# Altium project Guppy Buddy.PrjPCB (part 4 of 4)

## Sheet Cart.SchDoc: Cart
size Tabloid; ApprovedBy: NA; CompanyName: Cospan Design LLC; DrawnBy: David McCoy; Engineer: David McCoy; DocumentNumber: 12; Revision: A; SheetNumber: 12; SheetTotal: 18; Client: OSH; Project: Guppy Buddy; ProjectPrettyName: Guppy Buddy
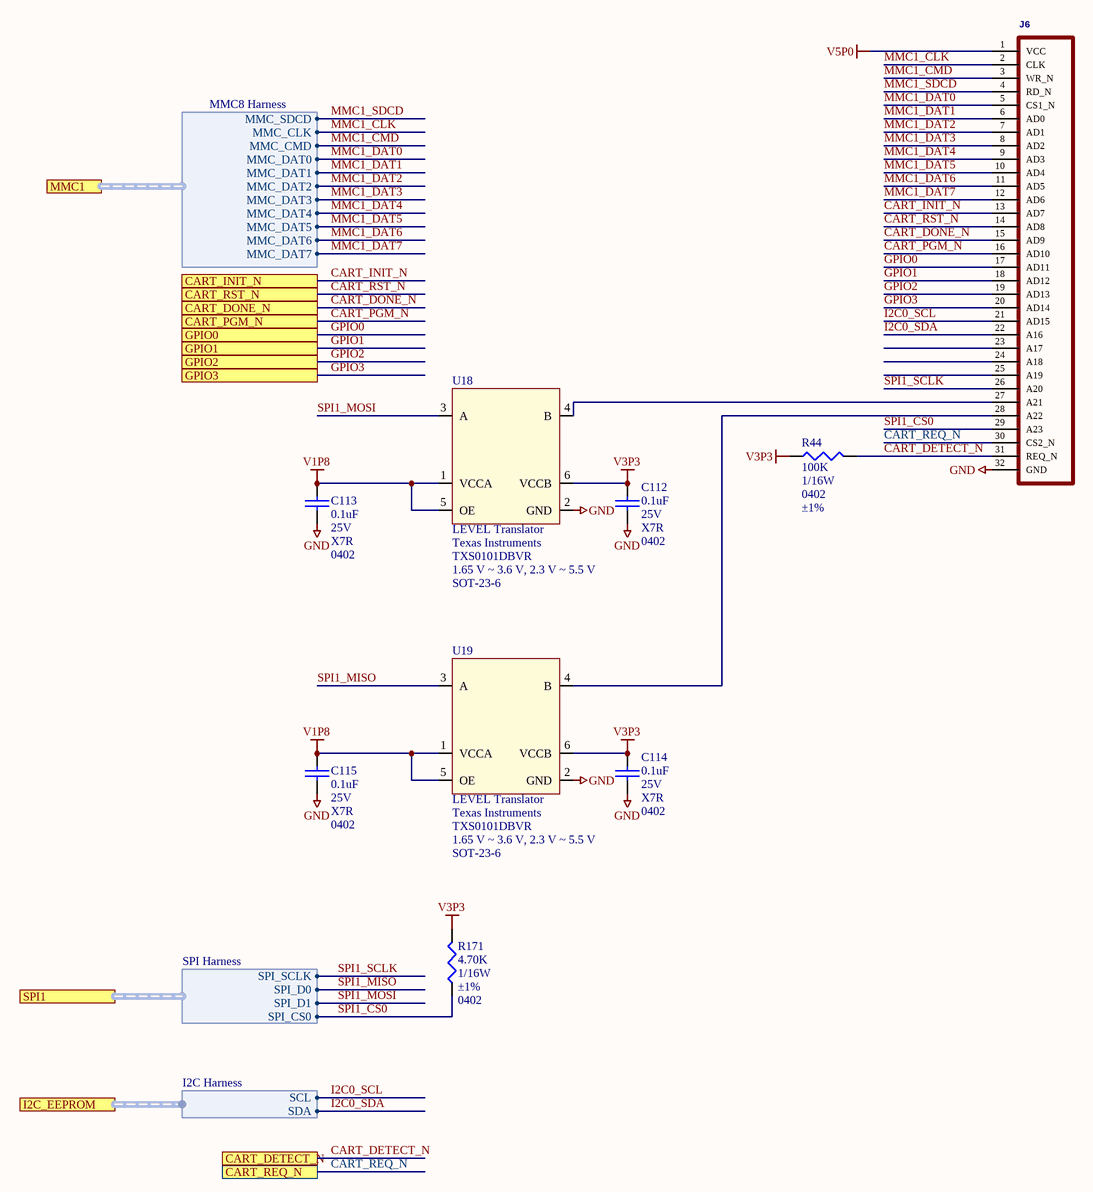
[diagram p5: Cart.SchDoc]

### Parts
C112  Capacitance: 0.1uF  Voltage - Rated: 25V  Temperature Coefficient: X7R  Package / Case: 0402  [C_0402]  (hidden comment: C_0402_0.1UF_25V)
C113  Capacitance: 0.1uF  Voltage - Rated: 25V  Temperature Coefficient: X7R  Package / Case: 0402  [C_0402]  (hidden comment: C_0402_0.1UF_25V)
C114  Capacitance: 0.1uF  Voltage - Rated: 25V  Temperature Coefficient: X7R  Package / Case: 0402  [C_0402]  (hidden comment: C_0402_0.1UF_25V)
C115  Capacitance: 0.1uF  Voltage - Rated: 25V  Temperature Coefficient: X7R  Package / Case: 0402  [C_0402]  (hidden comment: C_0402_0.1UF_25V)
J6  GB_CART1  [GB_CART]  (value not drawn)
R44  Resistance In Ohms: 100K  Power (Watts): 1/16W  Case: 0402  Tolerance: ±1%  [R_0402]  (hidden comment: R_0402_100K)
R171  Resistance In Ohms: 4.70K  Power (Watts): 1/16W  Tolerance: ±1%  Case: 0402  [R_0402]  (hidden comment: 4.7k Ohms)
U18  LEVEL Translator  Manufacturer: Texas Instruments  Manufacturer Part Number: TXS0101DBVR  Voltage - Supply: 1.65 V ~ 3.6 V, 2.3 V ~ 5.5 V  Package / Case: SOT-23-6  [TSOT-6]
U19  LEVEL Translator  Manufacturer: Texas Instruments  Manufacturer Part Number: TXS0101DBVR  Voltage - Supply: 1.65 V ~ 3.6 V, 2.3 V ~ 5.5 V  Package / Case: SOT-23-6  [TSOT-6]

### Ports
CART_DETECT_N, CART_DONE_N, CART_INIT_N, CART_PGM_N, CART_REQ_N, CART_RST_N, GPIO0, GPIO1, GPIO2, GPIO3, I2C_EEPROM (harness I2C Harness), MMC1 (harness MMC8 Harness), SPI1 (harness SPI Harness)

### Harnesses
SPI Harness: SPI_SCLK, SPI_D0, SPI_D1, SPI_CS0
MMC8 Harness: MMC_SDCD, MMC_CLK, MMC_CMD, MMC_DAT0, MMC_DAT1, MMC_DAT2, MMC_DAT3, MMC_DAT4, MMC_DAT5, MMC_DAT6, MMC_DAT7
I2C Harness: SCL, SDA

### Nets
GND: C112.1 C113.1 C114.1 C115.1 J6.32(GND) U18.2(GND) U19.2(GND)
V1P8: C113.2 C115.2 U18.1(VCCA) U18.5(OE) U19.1(VCCA) U19.5(OE)
V3P3: C112.2 C114.2 R44.2 R171.1 U18.6(VCCB) U19.6(VCCB)
V5P0: J6.1(VCC)
CART_DETECT_N: J6.31(REQ_N) R44.1 ; port CART_DETECT_N
CART_DONE_N: J6.15(AD9) ; port CART_DONE_N
CART_INIT_N: J6.13(AD7) ; port CART_INIT_N
CART_PGM_N: J6.16(AD10) ; port CART_PGM_N
CART_REQ_N: J6.30(CS2_N) ; port CART_REQ_N
CART_RST_N: J6.14(AD8) ; port CART_RST_N
GPIO0: J6.17(AD11) ; port GPIO0
GPIO1: J6.18(AD12) ; port GPIO1
GPIO2: J6.19(AD13) ; port GPIO2
GPIO3: J6.20(AD14) ; port GPIO3
I2C0_SCL: J6.21(AD15) ; port I2C_EEPROM.SCL
I2C0_SDA: J6.22(A16) ; port I2C_EEPROM.SDA
MMC1_CLK: J6.2(CLK) ; port MMC1.MMC_CLK
MMC1_CMD: J6.3(WR_N) ; port MMC1.MMC_CMD
MMC1_DAT0: J6.5(CS1_N) ; port MMC1.MMC_DAT0
MMC1_DAT1: J6.6(AD0) ; port MMC1.MMC_DAT1
MMC1_DAT2: J6.7(AD1) ; port MMC1.MMC_DAT2
MMC1_DAT3: J6.8(AD2) ; port MMC1.MMC_DAT3
MMC1_DAT4: J6.9(AD3) ; port MMC1.MMC_DAT4
MMC1_DAT5: J6.10(AD4) ; port MMC1.MMC_DAT5
MMC1_DAT6: J6.11(AD5) ; port MMC1.MMC_DAT6
MMC1_DAT7: J6.12(AD6) ; port MMC1.MMC_DAT7
MMC1_SDCD: J6.4(RD_N) ; port MMC1.MMC_SDCD
SPI1_CS0: J6.29(A23) R171.2 ; port SPI1.SPI_CS0
SPI1_MISO: U19.3(A) ; port SPI1.SPI_D0
SPI1_MOSI: U18.3(A) ; port SPI1.SPI_D1
SPI1_SCLK: J6.26(A20) ; port SPI1.SPI_SCLK
NetJ6_27: J6.27(A21) U18.4(B)
NetJ6_28: J6.28(A22) U19.4(B)

Not connected (* = marked no-connect by the designer): J6 23(A17) 24(A18) 25(A19)

### Notes on the sheet
- Project:
- http://www.cospandesign.com
- Cospan Design
- Document:
- Engineer:
- Title:
- Client:
- Approved By:
- Revision:
- Date:
- Number:
- of

### Library data of the parts
C112-C115 = C_0402_0.1UF_25V: CAP CER 0.1UF 25V X6S 0402; Manufacturer 1: Yageo; Manufacturer Part Number 1: CC0402KRX7R8BB104; Description 1: Cap Ceramic 0.1uF 25V X7R 10% SMD 0402 125C Paper T/R; Tolerance: 10%; Dissipation Factor: 3.5%; ComponentLink1URL: https://product.tdk.com/info/en/catalog/datasheets/mlcc_commercial_general_en.pdf; ComponentLink1Description: https://product.tdk.com/info/en/catalog/datasheets/mlcc_commercial_general_en.pdf; Supplier 1: Digi-Key; Supplier Part Number 1: 311-2077-1-ND; Stock 1: 0; Pricing 1: 1=0.1, 10=0.048, 100=0.0215, 500=0.01534, 1000=0.01205, 2500=0.01095, 5000=0.01007 (USD); Mount: Surface Mount; Case/Package: 0402; Case Code (Imperial): 0402; Case Code (Metric): 1005; Min Operating Temperature: -55°C; Max Operating Temperature: 125°C; Voltage Rating: 25V; Voltage Rating (DC): 25V; Packaging: Tape and Reel; Dielectric: X7R; Termination: SMD/SMT; Composition: Ceramic; Length: 1mm; Height: 0.5mm; Width: 0.02inch; Thickness: 0.022inch; Depth: 0.5mm; Radiation Hardening: No; Lead Free: Lead Free; Halogen Free: Halogen Free; ComponentLink2URL: https://datasheet.ciiva.com/11464/upy-gphc-x7r-6-3v-to-50v-8-11464889.pdf; ComponentLink2Description: https://datasheet.ciiva.com/11464/upy-gphc-x7r-6-3v-to-50v-8-11464889.pdf; ComponentLink3URL: https://datasheet.ciiva.com/13210/upy-gphc-x7r-6-3v-to-50v-8-12304-13210908.pdf; ComponentLink3Description: https://datasheet.ciiva.com/13210/upy-gphc-x7r-6-3v-to-50v-8-12304-13210908.pdf; ComponentLink4URL: https://datasheet.ciiva.com/17437/upy-gphc-x7r-6-3v-to-50v-8-17437357.pdf; ComponentLink4Description: https://datasheet.ciiva.com/17437/upy-gphc-x7r-6-3v-to-50v-8-17437357.pdf
J6 = J_GB_CART: Manufacturer 1: Amazon; DeviceName: 1; SymbolName_1: GB_CART; LibraryName: alex; DeviceSetName: GB_CART; Manufacturer Part Number 1: https://smile.amazon.com/Replacement-Cartridge-Card-Reader-Repair-Nintendo/dp/B077FV5W1L/ref=smi_ge_cnf_cnf_smi?_encoding=UTF8&adFormat=grid&adId=B077FV5W1L&adMode=auto&adType=smart&creativeASIN=B077FV5W1L&ie=UTF8&imprToken=YMtJVGSB8f0LFilQNy7ahg&impressionTimestamp=1529762984662&linkCode=w41&linkId=45a1439b5f48b7417e3978fa0774d918&pldnNewCustomer=1&ref-refURL=https%3A%2F%2Fhandheldlegend.com%2Fproducts%2Fgame-boy-cartridge-slot&slotNum=0&tag=hanhelleg-20
R44 = R_0402_100K: RES SMD 100K OHM 1% 1/16W 0402; Manufacturer: Yageo; Manufacturer Part Number: RC0402FR-07100KL; Temperature Coefficient: ±100ppm/°C; Supplier 1: Digi-Key; RoHS: RoHS Compliant; Category: Resistors; Stock 1: 4989982; Pricing 1: 1=0.1, 10=0.013, 25=0.0096, 100=0.0054, 250=0.00412, 500=0.00328, 1000=0.00242, 2500=0.0021, 5000=0.00173 (USD); Packaging: Cut Tape (CT); Resistance (Ohms): 100k; Composition: Thick Film; Features: Moisture Resistant; Operating Temperature: -55°C ~ 155°C; Package / Case: 0402 (1005 Metric); Supplier Device Package: 0402; Size / Dimension: 0.039" L x 0.020" W (1.00mm x 0.50mm); Height: 0.016" (0.40mm); Number of Terminations: 2; ComponentLink1URL: http://www.yageo.com/NewPortal/yageodocoutput?fileName=/pdf/R-Chip/PYu-RC_Group_51_RoHS_L_3.pdf; ComponentLink1Description: http://www.yageo.com/NewPortal/yageodocoutput?fileName=/pdf/R-Chip/PYu-RC_Group_51_RoHS_L_3.pdf; Supplier Part Number 1: 311-100KLRCT-ND
R171 = R_0402_4.70K: RES 4.70K OHM 1/16W 1% 0402 SMD; Manufacturer: Yageo; Manufacturer Part Number: RC0402FR-074K7L; Temperature Coefficient: ±100ppm/°C; Supplier 1: Digi-Key; Supplier Part Number 1: 311-4.7KLRCT-ND; RoHS: RoHS Compliant; Category: Resistors; Stock 1: 3610; Pricing: 10=0.014, 100=0.0063, 500=0.00382, 1000=0.0027, 5000=0.00203 (USD); Resistance (Ohms): 4.7K; Composition: Thick Film; Features: -; Package / Case: 0402 (1005 Metric); Size / Dimension: 0.039" L x 0.020" W (1.00mm x 0.50mm); Height: 0.016" (0.40mm); Number of Terminations: 2; Packaging: Cut Tape (CT); ComponentLink1URL: http://www.yageo.com/documents/recent/PYu-RC0402_51_RoHS_L_6.pdf; ComponentLink1Description: http://www.yageo.com/documents/recent/PYu-RC0402_51_RoHS_L_6.pdf
U18 U19 = U_TXS0101DBVR: IC V-LEVEL TRANSL BI-DIR SOT23-6; Logic Function: Translator, Bidirectional, Open Drain; Number of Bits: 1; Input Type: Voltage; Data Rate: 24Mbps; Differential - Input:Output: No/No; Propagation Delay (Max): 4.6ns; Supplier 1: Digi-Key; RoHS: RoHS Compliant; Category: Integrated Circuits (ICs); Stock 1: 19555; Pricing 1: 1=0.82, 10=0.722, 25=0.638, 100=0.556, 250=0.484, 500=0.412, 1000=0.33 (USD); Packaging: Cut Tape (CT); Output Type: Voltage; Number of Channels: 1; Number of Outputs/Channel: 1; Operating Temperature: -40°C ~ 85°C; Supplier Device Package: SOT-23-6; ComponentLink1URL: http://www.ti.com/lit/ds/symlink/txs0101.pdf; ComponentLink1Description: http://www.ti.com/lit/ds/symlink/txs0101.pdf; Supplier Part Number 1: 296-22863-1-ND

## Sheet Audio Codec.SchDoc: Audio Codec
size Tabloid; ApprovedBy: NA; CompanyName: Cospan Design LLC; DrawnBy: David McCoy; Engineer: David McCoy; DocumentNumber: 13; Revision: A; SheetNumber: 13; SheetTotal: 18; Client: OSH; Project: Guppy Buddy; ProjectPrettyName: Guppy Buddy
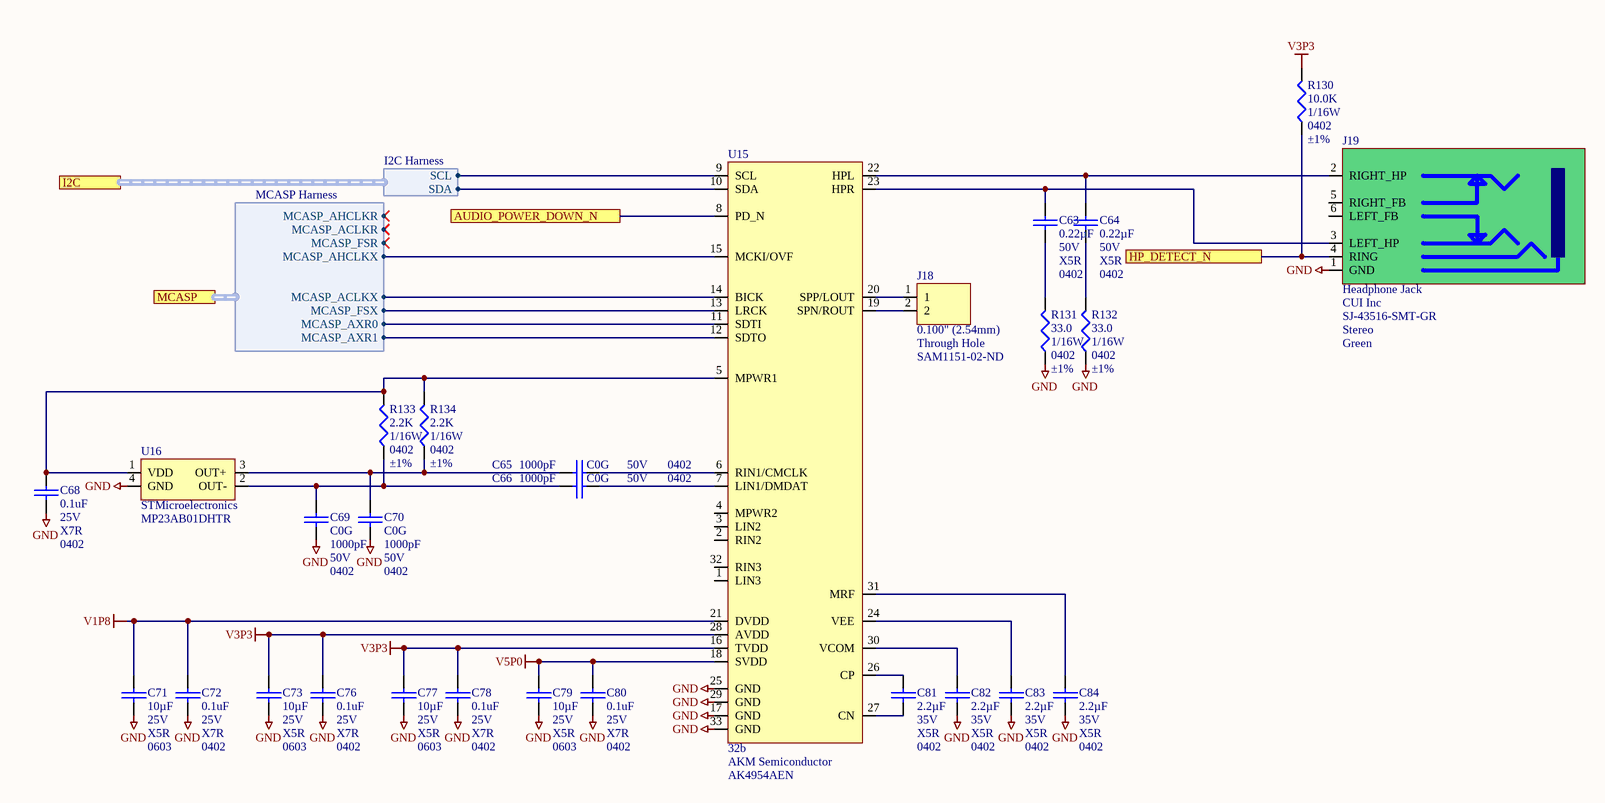
[diagram p6: Audio Codec.SchDoc]

### Parts
C63  Capacitance: 0.22µF  Voltage - Rated: 50V  Temperature Coefficient: X5R  Package / Case: 0402  [C_ERA-0402]  (hidden comment: C_0402_0.22UF_50V)
C64  Capacitance: 0.22µF  Voltage - Rated: 50V  Temperature Coefficient: X5R  Package / Case: 0402  [C_ERA-0402]  (hidden comment: C_0402_0.22UF_50V)
C65  Temperature Coefficient: C0G  Voltage - Rated: 50V  Package / Case: 0402  [C_ERA-0402]  (hidden comment: 1000pF)
C66  Temperature Coefficient: C0G  Voltage - Rated: 50V  Package / Case: 0402  [C_ERA-0402]  (hidden comment: 1000pF)
C68  Capacitance: 0.1uF  Voltage - Rated: 25V  Temperature Coefficient: X7R  Package / Case: 0402  [C_0402]  (hidden comment: C_0402_0.1UF_25V)
C69  Temperature Coefficient: C0G  Voltage - Rated: 50V  Package / Case: 0402  [C_ERA-0402]  (hidden comment: 1000pF)
C70  Temperature Coefficient: C0G  Voltage - Rated: 50V  Package / Case: 0402  [C_ERA-0402]  (hidden comment: 1000pF)
C71  Capacitance: 10µF  Voltage - Rated: 25V  Temperature Coefficient: X5R  Package / Case: 0603  [C_ERA-0603]  (hidden comment: C_0603_10µF)
C72  Capacitance: 0.1uF  Voltage - Rated: 25V  Temperature Coefficient: X7R  Package / Case: 0402  [C_0402]  (hidden comment: C_0402_0.1UF_25V)
C73  Capacitance: 10µF  Voltage - Rated: 25V  Temperature Coefficient: X5R  Package / Case: 0603  [C_ERA-0603]  (hidden comment: C_0603_10µF)
C76  Capacitance: 0.1uF  Voltage - Rated: 25V  Temperature Coefficient: X7R  Package / Case: 0402  [C_0402]  (hidden comment: C_0402_0.1UF_25V)
C77  Capacitance: 10µF  Voltage - Rated: 25V  Temperature Coefficient: X5R  Package / Case: 0603  [C_ERA-0603]  (hidden comment: C_0603_10µF)
C78  Capacitance: 0.1uF  Voltage - Rated: 25V  Temperature Coefficient: X7R  Package / Case: 0402  [C_0402]  (hidden comment: C_0402_0.1UF_25V)
C79  Capacitance: 10µF  Voltage - Rated: 25V  Temperature Coefficient: X5R  Package / Case: 0603  [C_ERA-0603]  (hidden comment: C_0603_10µF)
C80  Capacitance: 0.1uF  Voltage - Rated: 25V  Temperature Coefficient: X7R  Package / Case: 0402  [C_0402]  (hidden comment: C_0402_0.1UF_25V)
C81  Capacitance: 2.2µF  Voltage - Rated: 35V  Temperature Coefficient: X5R  Package / Case: 0402  [C_ERA-0402]  (hidden comment: C_0402_2.2uF_35V)
C82  Capacitance: 2.2µF  Voltage - Rated: 35V  Temperature Coefficient: X5R  Package / Case: 0402  [C_ERA-0402]  (hidden comment: C_0402_2.2uF_35V)
C83  Capacitance: 2.2µF  Voltage - Rated: 35V  Temperature Coefficient: X5R  Package / Case: 0402  [C_ERA-0402]  (hidden comment: C_0402_2.2uF_35V)
C84  Capacitance: 2.2µF  Voltage - Rated: 35V  Temperature Coefficient: X5R  Package / Case: 0402  [C_ERA-0402]  (hidden comment: C_0402_2.2uF_35V)
J18  Pitch: 0.100" (2.54mm)  Mounting Type: Through Hole  Supplier Part Number 1: SAM1151-02-ND  [1X2_HOLES_VERTICAL_FEMALE_HEADRER]  (hidden comment: J_HDR1X2_THRHOLE_VERT_FEMALE)
J19  Headphone Jack  Manufacturer: CUI Inc  Manufacturer Part Number: SJ-43516-SMT-GR  Signal Lines: Stereo  Color: Green  [HEADPHONE_JACK]
R130  Resistance In Ohms: 10.0K  Power (Watts): 1/16W  Case: 0402  Tolerance: ±1%  [R_0402]  (hidden comment: R_0402_10.0K)
R131  Resistance In Ohms: 33.0  Power (Watts): 1/16W  Case: 0402  Tolerance: ±1%  [R_0402]  (hidden comment: R_0402_33)
R132  Resistance In Ohms: 33.0  Power (Watts): 1/16W  Case: 0402  Tolerance: ±1%  [R_0402]  (hidden comment: R_0402_33)
R133  Resistance In Ohms: 2.2K  Power (Watts): 1/16W  Case: 0402  Tolerance: ±1%  [R_0402]  (hidden comment: R_0402_2.2K)
R134  Resistance In Ohms: 2.2K  Power (Watts): 1/16W  Case: 0402  Tolerance: ±1%  [R_0402]  (hidden comment: R_0402_2.2K)
U15  Resolution: 32b  Manufacturer 1: AKM Semiconductor  Manufacturer Part Number 1: AK4954AEN  [QFN40P400X400X80_HS-33N]  (hidden comment: U_AK4954AEN)
U16  Manufacturer 1: STMicroelectronics  Manufacturer Part Number 1: MP23AB01DHTR  [RHLGA]  (hidden comment: U_MP23AB01DHTR)

### Ports
AUDIO_POWER_DOWN_N, HP_DETECT_N, I2C (harness I2C Harness), MCASP (harness MCASP Harness)

### Harnesses
I2C Harness: SCL, SDA
MCASP Harness: MCASP_ACLKX, MCASP_FSX, MCASP_AXR0, MCASP_AHCLKR, MCASP_ACLKR, MCASP_FSR, MCASP_AXR1, MCASP_AHCLKX

### Nets
GND: C68.1 C69.2 C70.2 C71.1 C72.1 C73.1 C76.1 C77.1 C78.1 C79.1 C80.1 C82.1 C83.1 C84.1 J19.1(GND) R131.2 R132.2 U15.17(GND) U15.25(GND) U15.29(GND) U15.33(GND) U16.4(GND)
V1P8: C71.2 C72.2 U15.21(DVDD)
V3P3: C73.2 C76.2 C77.2 C78.2 R130.1 U15.16(TVDD) U15.28(AVDD)
V5P0: C79.2 C80.2 U15.18(SVDD)
HP_DETECT_N: J19.4(RING) R130.2 ; port HP_DETECT_N
NetC63_1: C63.1 R131.1
NetC63_2: C63.2 J19.3(LEFT_HP) U15.23(HPR)
NetC64_1: C64.1 R132.1
NetC64_2: C64.2 J19.2(RIGHT_HP) U15.22(HPL)
NetC65_1: C65.1 U15.6(RIN1/CMCLK)
NetC65_2: C65.2 C70.1 R134.2 U16.3(OUT+)
NetC66_1: C66.1 U15.7(LIN1/DMDAT)
NetC66_2: C66.2 C69.1 R133.2 U16.2(OUT-)
NetC68_2: C68.2 R133.1 R134.1 U15.5(MPWR1) U16.1(VDD)
NetC81_1: C81.1 U15.27(CN)
NetC81_2: C81.2 U15.26(CP)
NetC82_2: C82.2 U15.30(VCOM)
NetC83_2: C83.2 U15.24(VEE)
NetC84_2: C84.2 U15.31(MRF)
NetJ18_1: J18.1 U15.20(SPP/LOUT)
NetJ18_2: J18.2 U15.19(SPN/ROUT)
NetU15_8: U15.8(PD_N) ; port AUDIO_POWER_DOWN_N
NetU15_9: U15.9(SCL) ; port I2C.SCL
NetU15_10: U15.10(SDA) ; port I2C.SDA
NetU15_11: U15.11(SDTI) ; port MCASP.MCASP_AXR0
NetU15_12: U15.12(SDTO) ; port MCASP.MCASP_AXR1
NetU15_13: U15.13(LRCK) ; port MCASP.MCASP_FSX
NetU15_14: U15.14(BICK) ; port MCASP.MCASP_ACLKX
NetU15_15: U15.15(MCKI/OVF) ; port MCASP.MCASP_AHCLKX

Not connected (* = marked no-connect by the designer): J19 5(RIGHT_FB) 6(LEFT_FB); U15 1(LIN3) 2(RIN2) 3(LIN2) 4(MPWR2) 32(RIN3)

### Notes on the sheet
- Project:
- http://www.cospandesign.com
- Cospan Design
- Document:
- Engineer:
- Title:
- Client:
- Approved By:
- Revision:
- Date:
- Number:
- of

### Library data of the parts
C63 C64 = C_0402_0.22UF_50V: CAP CER 0.22UF 50V X5R 0402; Manufacturer: Taiyo Yuden; Manufacturer Part Number: UMK105BJ224KV-F; Tolerance: ±10%; Supplier 1: Digi-Key; RoHS: RoHS Compliant; Category: Capacitors; Stock 1: 141424; Pricing 1: 1=0.35, 10=0.263, 50=0.1532, 100=0.1225, 250=0.08752, 500=0.0595, 1000=0.04813, 5000=0.03763 (USD); Packaging: Digi-Reel®; Mounting Type: Surface Mount, MLCC; Operating Temperature: -55°C ~ 85°C; Applications: General Purpose; Ratings: -; Size / Dimension: 0.039" L x 0.020" W (1.00mm x 0.50mm); Height - Seated (Max): -; Thickness (Max): 0.022" (0.55mm); Lead Spacing: -; Features: -; Lead Style: -; ComponentLink1URL: http://ds.yuden.co.jp/TYCOMPAS/ut/detail.do?productNo=UMK105BJ224KV-F&fileName=UMK105BJ224KV-F_SS&mode=specSheetDownload; ComponentLink1Description: http://ds.yuden.co.jp/TYCOMPAS/ut/detail.do?productNo=UMK105BJ224KV-F&fileName=UMK105BJ224KV-F_SS&mode=specSheetDownload; Supplier Part Number 1: 587-3500-6-ND
C65 C66 C69 C70 = C_0402_1000PF_50V: CAP CER 1000PF 50V C0G 0402; Manufacturer: Murata Electronics North America; Manufacturer Part Number: GRM1555C1H102JA01D; Tolerance: ±5%; Supplier 1: Digi-Key; RoHS: RoHS Compliant; Category: Capacitors; Stock 1: 1327660; Pricing 1: 10=0.073, 100=0.0429, 500=0.02476, 1000=0.01716 (USD); Mounting Type: Surface Mount, MLCC; Operating Temperature: -55°C ~ 125°C; Features: -; Applications: General Purpose; Ratings: -; Size / Dimension: 0.040" L x 0.020" W (1.00mm x 0.50mm); Lead Spacing: -; Thickness: 0.50mm; Packaging: Cut Tape (CT); Lead Style: -; ComponentLink1URL: http://search.murata.co.jp/Ceramy/image/img/PDF/ENG/GRM1555C1H102JA01.pdf; ComponentLink1Description: http://search.murata.co.jp/Ceramy/image/img/PDF/ENG/GRM1555C1H102JA01.pdf; Supplier Part Number 1: 490-3244-1-ND; Capacitance: 1000pF
C68 C72 C76 C78 C80 = C_0402_0.1UF_25V: as C112 on sheet Cart; ComponentLink1URL: https://product.tdk.com/info/en/catalog/datasheets/mlcc_commercial_general_en.pdf; ComponentLink1Description: https://product.tdk.com/info/en/catalog/datasheets/mlcc_commercial_general_en.pdf; Supplier 1: Digi-Key; Supplier Part Number 1: 311-2077-1-ND; Stock 1: 0; Pricing 1: 1=0.1, 10=0.048, 100=0.0215, 500=0.01534, 1000=0.01205, 2500=0.01095, 5000=0.01007 (USD); Mount: Surface Mount; Case/Package: 0402; Case Code (Imperial): 0402; Case Code (Metric): 1005; Min Operating Temperature: -55°C; Max Operating Temperature: 125°C; Voltage Rating: 25V; Voltage Rating (DC): 25V; Packaging: Tape and Reel; Dielectric: X7R; Termination: SMD/SMT; Composition: Ceramic; Length: 1mm; Height: 0.5mm; Width: 0.02inch; Thickness: 0.022inch; Depth: 0.5mm; Radiation Hardening: No; Lead Free: Lead Free; Halogen Free: Halogen Free; ComponentLink2URL: https://datasheet.ciiva.com/11464/upy-gphc-x7r-6-3v-to-50v-8-11464889.pdf; ComponentLink2Description: https://datasheet.ciiva.com/11464/upy-gphc-x7r-6-3v-to-50v-8-11464889.pdf; ComponentLink3URL: https://datasheet.ciiva.com/13210/upy-gphc-x7r-6-3v-to-50v-8-12304-13210908.pdf; ComponentLink3Description: https://datasheet.ciiva.com/13210/upy-gphc-x7r-6-3v-to-50v-8-12304-13210908.pdf; ComponentLink4URL: https://datasheet.ciiva.com/17437/upy-gphc-x7r-6-3v-to-50v-8-17437357.pdf; ComponentLink4Description: https://datasheet.ciiva.com/17437/upy-gphc-x7r-6-3v-to-50v-8-17437357.pdf
C71 C73 C77 C79 = C_0603_10µF: CAP CER 10UF 16V X5R 0603; Manufacturer: Murata Electronics North America; Manufacturer Part Number: GRM188R61C106MA73D; Tolerance: ±20%; Supplier 1: Digi-Key; RoHS: RoHS Compliant; Category: Capacitors; Stock 1: 450536; Pricing 1: 1=0.35, 10=0.303, 50=0.184, 100=0.1516, 250=0.12124, 500=0.11042, 1000=0.09959 (USD); Packaging: Cut Tape (CT); Mounting Type: Surface Mount, MLCC; Operating Temperature: -55°C ~ 85°C; Applications: General Purpose; Ratings: -; Size / Dimension: 0.063" L x 0.031" W (1.60mm x 0.80mm); Height - Seated (Max): -; Thickness (Max): 0.031" (0.80mm); Lead Spacing: -; Features: -; Lead Style: -; ComponentLink1URL: http://www.murata.com/~/media/webrenewal/support/library/catalog/products/capacitor/mlcc/c02e.pdf; ComponentLink1Description: http://www.murata.com/~/media/webrenewal/support/library/catalog/products/capacitor/mlcc/c02e.pdf; Supplier Part Number 1: 490-7201-1-ND
C81-C84 = C_0402_2.2uF_35V: CAP CER 2.2UF 35V 20% X5R 0402; Manufacturer: TDK Corporation; Manufacturer Part Number: C1005X5R1V225K050BC; Tolerance: ±10%; Supplier 1: Digi-Key; RoHS: RoHS Compliant; Category: Capacitors; Stock 1: 300469; Pricing 1: 1=0.36, 10=0.253, 100=0.1518, 500=0.11386, 1000=0.09614, 2500=0.09108, 5000=0.08602 (USD); Packaging: Cut Tape (CT); Part Status: Active; Operating Temperature: -55°C ~ 85°C; Features: Low ESL; Ratings: -; Applications: General Purpose; Failure Rate: -; Mounting Type: Surface Mount, MLCC; Size / Dimension: 0.039" L x 0.020" W (1.00mm x 0.50mm); Height - Seated (Max): -; Thickness (Max): 0.022" (0.55mm); Lead Spacing: -; Lead Style: -; ComponentLink1URL: https://product.tdk.com/info/en/catalog/datasheets/mlcc_commercial_general_en.pdf; ComponentLink1Description: https://product.tdk.com/info/en/catalog/datasheets/mlcc_commercial_general_en.pdf; Supplier Part Number 1: 445-9028-1-ND
J18 = J_HDR1X2_THRHOLE_VERT_FEMALE: CONN RCPT .100" 2POS SNGL HORZ; Manufacturer: Samtec Inc; Manufacturer Part Number: SSM-102-S-SH; Connector Type: Receptacle; Number of Positions: 2; Number of Positions Loaded: All; Supplier 1: Digi-Key; RoHS: RoHS Compliant; Category: Connectors, Interconnects; Stock 1: 0; Pricing 1: 1=0 (USD); Packaging: Tube; Contact Type: Female Socket; Number of Rows: 1; Row Spacing: -; Termination: Solder; Fastening Type: -; Features: -; Contact Finish: Gold; Contact Finish Thickness: 30µin (0.76µm); Color: Black; ComponentLink1URL: http://www.samtec.com/ftppub/cpdf/SSM-1XX-XXX-XX-XX-XX-X-XX-XX-MKT.pdf; ComponentLink1Description: http://www.samtec.com/ftppub/cpdf/SSM-1XX-XXX-XX-XX-XX-X-XX-XX-MKT.pdf
J19 = J_HEADPHONE_JACK: CONN AUDIO JACK 3.5MM 4COND SMD; Gender: Female; Plug/Mating Plug Diameter: 3.50mm (0.141", 1/8", Mini Plug) - Headphone; Number of Positions/Contacts: 4 Conductors, 6 Contacts; Internal Switch(s): Two Switches; Shielding: Unshielded; Supplier 1: Digi-Key; Supplier Part Number 1: CP-43516SJGRCT-ND; RoHS: RoHS Compliant; Category: Connectors, Interconnects; Stock 1: 3934; Pricing: 1=1.26, 10=0.982, 100=0.749, 500=0.59796 (USD); Connector Type: Phone Jack; Mounting Type: Surface Mount, Right Angle; Termination: Solder; Features: Board Guide; Packaging: Cut Tape (CT); ComponentLink1URL: http://products.cui.com/GetSpecForDigikey.aspx?MFGNum=SJ-43516-SMT; ComponentLink1Description: http://products.cui.com/GetSpecForDigikey.aspx?MFGNum=SJ-43516-SMT
R130 = R_0402_10.0K: as R79-R85 on sheet WIFI Bluetooth; Supplier 1: Digi-Key; Supplier Part Number 1: RMCF0402FT10K0CT-ND; RoHS: RoHS Compliant; Category: Resistors; Stock 1: 234525; Pricing: 1=0.04, 10=0.025, 50=0.0138, 100=0.0105, 250=0.0078, 500=0.00576, 1000=0.00384, 2500=0.00324, 5000=0.0027 (USD); Composition: Thick Film; Features: -; Package / Case: 0402 (1005 Metric); Size / Dimension: 0.039" L x 0.020" W (1.00mm x 0.50mm); Height: 0.016" (0.40mm); Number of Terminations: 2; Packaging: Cut Tape (CT); ComponentLink1URL: http://www.seielect.com/Catalog/SEI-RMCF_RMCP.pdf; ComponentLink1Description: http://www.seielect.com/Catalog/SEI-RMCF_RMCP.pdf
R131 R132 = R_0402_33: RES 33.0 OHM 1/16W 1% 0402 SMD; Manufacturer: Yageo; Manufacturer Part Number: RC0402FR-0733RL; Resistance (Ohms): 33; Temperature Coefficient: ±100ppm/°C; Supplier 1: Digi-Key; Supplier Part Number 1: 311-33.0LRCT-ND; RoHS: RoHS Compliant; Category: Resistors; Stock 1: 733920; Pricing: 10=0.014, 50=0.0104, 100=0.0079, 250=0.00584, 500=0.00432, 1000=0.00288 (USD); Composition: Thick Film; Features: -; Size / Dimension: 0.039" L x 0.020" W (1.00mm x 0.50mm); Height: 0.014" (0.35mm); Number of Terminations: 2; Packaging: Cut Tape (CT); Package / Case: 0402 (1005 Metric); ComponentLink1URL: http://www.yageo.com/documents/recent/PYu-RC0402_51_RoHS_L_6.pdf; ComponentLink1Description: http://www.yageo.com/documents/recent/PYu-RC0402_51_RoHS_L_6.pdf
R133 R134 = R_0402_2.2K: RES SMD 2.2K OHM 1% 1/10W 0402; Manufacturer: Panasonic Electronic Components; Manufacturer Part Number: ERJ-2RKF2201X; Temperature Coefficient: ±100ppm/°C; Supplier 1: Digi-Key; RoHS: RoHS Compliant; Category: Resistors; Stock 1: 1256647; Pricing 1: 1=0.1, 50=0.015, 100=0.011, 250=0.0084, 500=0.00674, 1000=0.00496, 5000=0.00355 (USD); Packaging: Cut Tape (CT); Resistance (Ohms): 2.2k; Composition: Thick Film; Features: Automotive AEC-Q200; Operating Temperature: -55°C ~ 155°C; Package / Case: 0402 (1005 Metric); Supplier Device Package: 0402; Size / Dimension: 0.039" L x 0.020" W (1.00mm x 0.50mm); Height: 0.016" (0.40mm); Number of Terminations: 2; ComponentLink1URL: http://industrial.panasonic.com/www-cgi/jvcr13pz.cgi?E+PZ+3+AOA0002+ERJ2RKF2201X+7+WW; ComponentLink1Description: http://industrial.panasonic.com/www-cgi/jvcr13pz.cgi?E+PZ+3+AOA0002+ERJ2RKF2201X+7+WW; Supplier Part Number 1: P2.20KLCT-ND
U15 = U_AK4954AEN: IC STEREO CODEC 32BIT 32QFN; Interface: Serial; Supplier 1: Digi-Key; Supplier Part Number 1: 974-1065-1-ND; Description 1: IC STEREO CODEC 32BIT 32QFN; Stock 1: 0; Mount: Surface Mount; Min Operating Temperature: -30°C; Max Operating Temperature: 85°C; Packaging: Tape and Reel; ComponentLink1URL: http://www.akm.com/akm/en/file/datasheet/AK4954AEN.pdf; ComponentLink1Description: http://www.akm.com/akm/en/file/datasheet/AK4954AEN.pdf
U16 = U_MP23AB01DHTR: MIC MEMS ANALOG OMNI -38DB; Supplier 1: Digi-Key; Supplier Part Number 1: 497-17051-6-ND; Stock 1: 5150; Pricing 1: 1=1.59, 10=1.257, 100=1.0017, 500=0.84854, 1000=0.7975 (USD); ComponentLink1URL: http://www.farnell.com/datasheets/2310300.pdf; ComponentLink1Description: http://www.farnell.com/datasheets/2310300.pdf

## Sheet 1.8V Regulator.SchDoc: 1.8V Regulator
size Tabloid; Date: 1/20/2016; ApprovedBy: NA; CompanyName: Cospan Design LLC; DrawnBy: David McCoy; Engineer: David McCoy; DocumentNumber: 18; Revision: A; SheetNumber: 18; SheetTotal: 18; Client: OSH; ProjectPrettyName: Guppy Buddy; Project: Guppy Buddy; ProjectName: Edenis: TX Adapter
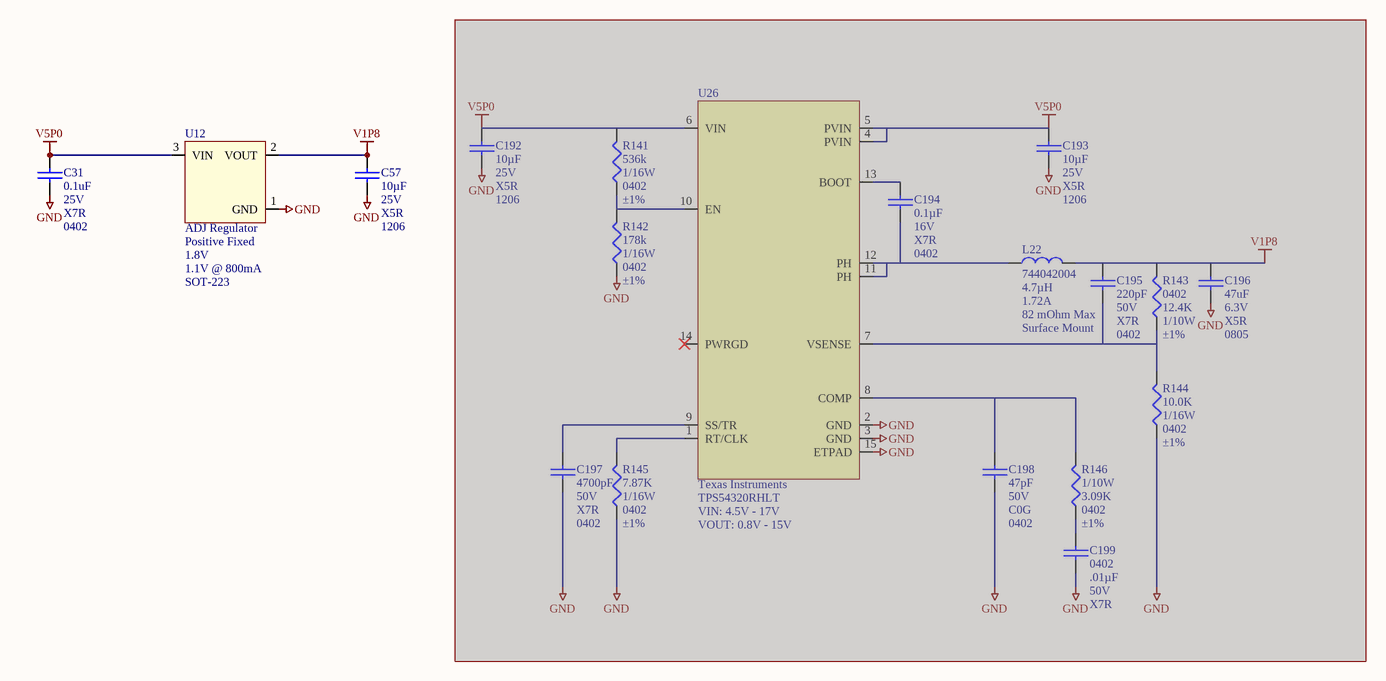
[diagram p7: 1.8V Regulator.SchDoc]

### Parts
C31  Capacitance: 0.1uF  Voltage - Rated: 25V  Temperature Coefficient: X7R  Package / Case: 0402  [C_0402]  (hidden comment: C_0402_0.1UF_25V)
C57  Voltage - Rated: 25V  Temperature Coefficient: X5R  Package / Case: 1206  [CAP-1206]  (hidden comment: 10µF)
C192  Voltage - Rated: 25V  Temperature Coefficient: X5R  Package / Case: 1206  [CAP-1206]  (hidden comment: 10µF)  (masked out: inside a compile mask, not in the netlist)
C193  Voltage - Rated: 25V  Temperature Coefficient: X5R  Package / Case: 1206  [CAP-1206]  (hidden comment: 10µF)  (masked out: inside a compile mask, not in the netlist)
C194  Capacitance: 0.1µF  Voltage - Rated: 16V  Temperature Coefficient: X7R  Package / Case: 0402  [C_0402]  (hidden comment: 0.1uF)  (masked out: inside a compile mask, not in the netlist)
C195  Voltage - Rated: 50V  Temperature Coefficient: X7R  Package / Case: 0402  [C_0402]  (hidden comment: 220pF)  (masked out: inside a compile mask, not in the netlist)
C196  Capacitance: 47uF  Voltage - Rated: 6.3V  Temperature Coefficient: X5R  Package / Case: 0805  [C_ERA-0805]  (hidden comment: C_0805_47UF_6.3V)  (masked out: inside a compile mask, not in the netlist)
C197  Voltage - Rated: 50V  Temperature Coefficient: X7R  Package / Case: 0402  [C_0402]  (hidden comment: 4700pF)  (masked out: inside a compile mask, not in the netlist)
C198  Voltage - Rated: 50V  Temperature Coefficient: C0G  Package / Case: 0402  [C_0402]  (hidden comment: 47pF)  (masked out: inside a compile mask, not in the netlist)
C199  Package / Case: 0402  Capacitance: .01µF  Voltage - Rated: 50V  Temperature Coefficient: X7R  [C_ERA-0402]  (hidden comment: 10000pF)  (masked out: inside a compile mask, not in the netlist)
L22  Manufacturer Part Number: 744042004  Inductance: 4.7µH  Current: 1.72A  DC Resistance (DCR): 82 mOhm Max  Mounting Type: Surface Mount  [INDP744042006]  (hidden comment: 4.7uH)  (masked out: inside a compile mask, not in the netlist)
R141  Resistance In Ohms: 536k  Power (Watts): 1/16W  Case: 0402  Tolerance: ±1%  [R_0402]  (hidden comment: CRCW0402536KFKED)  (masked out: inside a compile mask, not in the netlist)
R142  Power (Watts): 1/16W  Case: 0402  Tolerance: ±1%  [R_0402]  (hidden comment: 178k)  (masked out: inside a compile mask, not in the netlist)
R143  Package / Case: 0402  Resistance (Ohms): 12.4K  Power (Watts): 1/10W  Tolerance: ±1%  [R_0402]  (hidden comment: R_0402_12.4K)  (masked out: inside a compile mask, not in the netlist)
R144  Resistance In Ohms: 10.0K  Power (Watts): 1/16W  Case: 0402  Tolerance: ±1%  [R_0402]  (hidden comment: R_0402_10.0K)  (masked out: inside a compile mask, not in the netlist)
R145  Resistance In Ohms: 7.87K  Power (Watts): 1/16W  Case: 0402  Tolerance: ±1%  [R_0402]  (hidden comment: R_0402_7.87K)  (masked out: inside a compile mask, not in the netlist)
R146  Power (Watts): 1/10W  Resistance In Ohms: 3.09K  Case: 0402  Tolerance: ±1%  [R_0402]  (hidden comment: 3.09k Ohms)  (masked out: inside a compile mask, not in the netlist)
U12  ADJ Regulator  Regulator Topology: Positive Fixed  Voltage - Output: 1.8V  Voltage - Dropout (Typical): 1.1V @ 800mA  Supplier Device Package: SOT-223  [SOT230P700X180-4N]
U26  Manufacturer: Texas Instruments  Manufacturer Part Number: TPS54320RHLT  Voltage - Input (Min - Max): VIN: 4.5V - 17V  Voltage - Output (Max): VOUT: 0.8V - 15V  [S-PVQFN-N14]  (hidden comment: U_TPS54320RHLT)  (masked out: inside a compile mask, not in the netlist)

### Nets
GND: C31.1 C57.1 U12.1(GND)
V1P8: C57.2 U12.2(VOUT)
V5P0: C31.2 U12.3(VIN)

### Notes on the sheet
- Project:
- http://www.cospandesign.com
- Cospan Design
- Document:
- Engineer:
- Title:
- Client:
- Approved By:
- Revision:
- Date:
- Number:
- of

### Library data of the parts
C31 = C_0402_0.1UF_25V: as C112 on sheet Cart; ComponentLink1URL: https://product.tdk.com/info/en/catalog/datasheets/mlcc_commercial_general_en.pdf; ComponentLink1Description: https://product.tdk.com/info/en/catalog/datasheets/mlcc_commercial_general_en.pdf; Supplier 1: Digi-Key; Supplier Part Number 1: 311-2077-1-ND; Stock 1: 0; Pricing 1: 1=0.1, 10=0.048, 100=0.0215, 500=0.01534, 1000=0.01205, 2500=0.01095, 5000=0.01007 (USD); Mount: Surface Mount; Case/Package: 0402; Case Code (Imperial): 0402; Case Code (Metric): 1005; Min Operating Temperature: -55°C; Max Operating Temperature: 125°C; Voltage Rating: 25V; Voltage Rating (DC): 25V; Packaging: Tape and Reel; Dielectric: X7R; Termination: SMD/SMT; Composition: Ceramic; Length: 1mm; Height: 0.5mm; Width: 0.02inch; Thickness: 0.022inch; Depth: 0.5mm; Radiation Hardening: No; Lead Free: Lead Free; Halogen Free: Halogen Free; ComponentLink2URL: https://datasheet.ciiva.com/11464/upy-gphc-x7r-6-3v-to-50v-8-11464889.pdf; ComponentLink2Description: https://datasheet.ciiva.com/11464/upy-gphc-x7r-6-3v-to-50v-8-11464889.pdf; ComponentLink3URL: https://datasheet.ciiva.com/13210/upy-gphc-x7r-6-3v-to-50v-8-12304-13210908.pdf; ComponentLink3Description: https://datasheet.ciiva.com/13210/upy-gphc-x7r-6-3v-to-50v-8-12304-13210908.pdf; ComponentLink4URL: https://datasheet.ciiva.com/17437/upy-gphc-x7r-6-3v-to-50v-8-17437357.pdf; ComponentLink4Description: https://datasheet.ciiva.com/17437/upy-gphc-x7r-6-3v-to-50v-8-17437357.pdf
C57 C192 C193 = C_1206_10UF_25V: CAP CER 10UF 25V X5R 1206; Manufacturer 1: Samsung; Manufacturer Part Number 1: CL31A106KAHNNNE; Tolerance: 10%; Description 1: Cap Ceramic 10uF 25V X5R 10% SMD 1206 85C T/R; Material: Ceramic; Supplier 1: Digi-Key; Supplier Part Number 1: 1276-1075-6-ND; Stock 1: 0; Height: 1.6mm; Thickness: 0.071inch; Packaging: Tape and Reel; ComponentLink1URL: http://search.murata.co.jp/Ceramy/image/img/PDF/ENG/GRM31CR61E106MA12.pdf; ComponentLink1Description: http://search.murata.co.jp/Ceramy/image/img/PDF/ENG/GRM31CR61E106MA12.pdf; Capacitance: 10µF; Pricing 1: 1=0.28, 10=0.188, 100=0.095, 500=0.065, 1000=0.0575 (USD); Mount: Surface Mount; Case/Package: 1206; Case Code (Metric): 3216; Case Code (Imperial): 1206; Contact Plating: Tin; Min Operating Temperature: -55°C; Max Operating Temperature: 85°C; Dielectric: X5R; Voltage: 25V; Voltage Rating (DC): 25V; Voltage Rating: 25V; Length: 3.2mm; Depth: 1.6mm; Width: 0.063inch; Radiation Hardening: No; Lead Free: Lead Free; ComponentLink2URL: https://datasheet.ciiva.com/25710/cl31a106kahnnne-25710837.pdf; ComponentLink2Description: https://datasheet.ciiva.com/25710/cl31a106kahnnne-25710837.pdf; ComponentLink3URL: https://datasheet.ciiva.com/15195/getdatasheetpartid-355210-15195990.pdf; ComponentLink3Description: https://datasheet.ciiva.com/15195/getdatasheetpartid-355210-15195990.pdf; ComponentLink4URL: https://datasheet.ciiva.com/16740/cl31a106kahnnne-16740633.pdf; ComponentLink4Description: https://datasheet.ciiva.com/16740/cl31a106kahnnne-16740633.pdf; ComponentLink5URL: https://datasheet.ciiva.com/29201/452519-da-01-en-vs-kondensator-1206-29201124.pdf; ComponentLink5Description: https://datasheet.ciiva.com/29201/452519-da-01-en-vs-kondensator-1206-29201124.pdf
C194 = C_0402_0.1UF_16V: CAP CER .10UF 16V X7R 0402; Manufacturer: Murata Electronics North America; Manufacturer Part Number: GRM155R71C104KA88J; Tolerance: ±10%; Supplier 1: Digi-Key; Supplier Part Number 1: 490-6328-1-ND; RoHS: RoHS Compliant; Category: Capacitors; Stock 1: 18077074; Mounting Type: Surface Mount, MLCC; Features: -; Lead Spacing: -; Packaging: Cut Tape (CT); ComponentLink1URL: http://www.murata.com/~/media/webrenewal/support/library/catalog/products/capacitor/mlcc/c02e.ashx; ComponentLink1Description: http://www.murata.com/~/media/webrenewal/support/library/catalog/products/capacitor/mlcc/c02e.ashx; Operating Temperature: -55°C ~ 125°C; Pricing 1: 1=0.1, 10=0.014, 100=0.0062, 500=0.00442, 1000=0.00348, 2500=0.00316, 5000=0.00291 (USD); Part Status: Active; Ratings: -; Applications: General Purpose; Size / Dimension: 0.039" L x 0.020" W (1.00mm x 0.50mm); Height - Seated (Max): -; Thickness (Max): 0.022" (0.55mm)
C195 = C_0402_220PF_50V: CAP CER 220PF 50V 10% X7R 0402; Manufacturer: Murata Electronics North America; Manufacturer Part Number: GRM155R71H221KA01D; Supplier 1: Digi-Key; Supplier Part Number 1: 490-1298-1-ND; RoHS: RoHS Compliant; Category: Capacitors; Stock 1: 239876; Pricing: 10=0.034, 50=0.0272, 100=0.0204, 250=0.01476, 500=0.0109, 1000=0.00738 (USD); Tolerance: ±10%; Mounting Type: Surface Mount, MLCC; Operating Temperature: -55°C ~ 125°C; Applications: General Purpose; Ratings: -; Size / Dimension: 0.039" L x 0.020" W (1.00mm x 0.50mm); Height: -; Thickness: 0.022" (0.55mm); Lead Spacing: -; Features: -; Packaging: Cut Tape (CT); Lead Style: -; ComponentLink1URL: http://search.murata.co.jp/Ceramy/image/img/PDF/ENG/GRM155R71H221KA01.pdf; ComponentLink1Description: http://search.murata.co.jp/Ceramy/image/img/PDF/ENG/GRM155R71H221KA01.pdf; Capacitance: 220pF
C196 = C_0805_47UF_6.3V: CAP CER 47UF 6.3V X5R 0805; Manufacturer: Taiyo Yuden; Manufacturer Part Number: JMK212BJ476MG-T; Tolerance: ±20%; Supplier 1: Digi-Key; Supplier Part Number 1: 587-1779-1-ND; RoHS: RoHS Compliant; Category: Capacitors; Stock 1: 228351; Pricing: 1=0.77, 10=0.737, 50=0.44, 100=0.3575, 250=0.297, 500=0.2695, 1000=0.2475 (USD); Mounting Type: Surface Mount, MLCC; Operating Temperature: -55°C ~ 85°C; Applications: General Purpose; Size / Dimension: 0.079" L x 0.049" W (2.00mm x 1.25mm); Thickness (Max): 0.053" (1.35mm); Packaging: Cut Tape (CT); ComponentLink1URL: http://www.yuden.co.jp/productdata/catalog/en/mlcc01_e.pdf; ComponentLink1Description: http://www.yuden.co.jp/productdata/catalog/en/mlcc01_e.pdf; Supplier 2: Digi-Key; Stock 2: 314741; Pricing 2: 1=0.77, 10=0.737, 25=0.5224, 50=0.44, 100=0.3575, 500=0.2695, 1000=0.2475 (USD); Ratings: -; Height - Seated (Max): -; Lead Spacing: -; Features: -; Lead Style: -; ComponentLink2URL: http://www.samsungsem.com/kr/support/product-search/mlcc/CL21A476MQCLRNC.jsp; ComponentLink2Description: http://www.samsungsem.com/kr/support/product-search/mlcc/CL21A476MQCLRNC.jsp; Supplier Part Number 2: 1276-2420-1-ND
C197 = C_0402_4700pF_50V: CAP CER 4700PF 50V 10% X7R 0402; Manufacturer: Yageo; Manufacturer Part Number: CC0402KRX7R9BB472; Supplier 1: Digi-Key; RoHS: RoHS Compliant; Category: Capacitors; Stock 1: 466253; Pricing 1: 1=0.1, 10=0.015, 25=0.0104, 100=0.0068, 250=0.00552, 500=0.00474, 1000=0.00369, 2500=0.00332, 5000=0.00308 (USD); Packaging: Cut Tape (CT); Tolerance: ±10%; Mounting Type: Surface Mount, MLCC; Operating Temperature: -55°C ~ 125°C; Applications: General Purpose; Ratings: -; Size / Dimension: 0.039" L x 0.020" W (1.00mm x 0.50mm); Height - Seated (Max): -; Thickness (Max): 0.022" (0.55mm); Lead Spacing: -; Features: -; Lead Style: -; ComponentLink1URL: http://www.yageo.com/documents/recent/UPY-GPHC_X7R_6.3V-to-50V-v12.pdf; ComponentLink1Description: http://www.yageo.com/documents/recent/UPY-GPHC_X7R_6.3V-to-50V-v12.pdf; Capacitance: 4700pF; Supplier Part Number 1: 311-1418-1-ND
C198 = C_0402_47p_50V: CAP CER 47PF 50V 5% C0G 0402; Manufacturer: Murata Electronics North America; Manufacturer Part Number: GRM1555C1H470JA01D; Supplier 1: Digi-Key; RoHS: RoHS Compliant; Category: Capacitors; Stock 1: 682755; Pricing 1: 1=0.1, 10=0.013, 50=0.007, 100=0.0059, 250=0.00488, 500=0.00416, 1000=0.00324, 5000=0.0027 (USD); Packaging: Cut Tape (CT); Tolerance: ±5%; Mounting Type: Surface Mount, MLCC; Operating Temperature: -55°C ~ 125°C; Applications: General Purpose; Ratings: -; Size / Dimension: 0.039" L x 0.020" W (1.00mm x 0.50mm); Height - Seated (Max): -; Thickness (Max): 0.022" (0.55mm); Lead Spacing: -; Features: -; Lead Style: -; ComponentLink1URL: http://www.murata.com/~/media/webrenewal/support/library/catalog/products/capacitor/mlcc/c02e.ashx; ComponentLink1Description: http://www.murata.com/~/media/webrenewal/support/library/catalog/products/capacitor/mlcc/c02e.ashx; Supplier Part Number 1: 490-5942-1-ND; Capacitance: 47pF
C199 = C_0402_10000PF_50V: CAP CERAMIC .01UF 50V X7R 0402; Manufacturer: Murata Electronics North America; Manufacturer Part Number: GRM155R71H103KA88D; Tolerance: ±10%; Supplier 1: Digi-Key; RoHS: RoHS Compliant; Category: Capacitors; Stock 1: 7255009; Pricing 1: 1=0.1, 50=0.0052, 100=0.0044, 250=0.00364, 500=0.00312, 1000=0.00242, 5000=0.00202 (USD); Mounting Type: Surface Mount, MLCC; Operating Temperature: -55°C ~ 125°C; Features: -; Applications: General Purpose; Ratings: -; Size / Dimension: 0.039" L x 0.020" W (1.00mm x 0.50mm); Lead Spacing: -; Lead Style: -; ComponentLink1URL: http://www.murata.com/~/media/webrenewal/support/library/catalog/products/capacitor/mlcc/c02e.ashx; ComponentLink1Description: http://www.murata.com/~/media/webrenewal/support/library/catalog/products/capacitor/mlcc/c02e.ashx; Supplier Part Number 1: 490-4516-1-ND; Packaging: Cut Tape (CT); Part Status: Active; Height - Seated (Max): -; Thickness (Max): 0.022" (0.55mm)
L22 = L_4.70UH_1.72A_SMD: INDUCTOR POWER 4.7UH 1.72A SMD; Manufacturer: Wurth Electronics Inc; Current - Saturation: 1.65A; Tolerance: ±30%; Shielding: Shielded; Frequency - Self Resonant: 70MHz; Frequency - Test: 100kHz; Supplier 1: Digi-Key; Supplier Part Number 1: 732-1021-1-ND; RoHS: RoHS Compliant; Category: Inductors, Coils, Chokes; Stock 1: 9223; Pricing: 1=1.85, 25=1.5444, 100=1.3128, 250=1.15836 (USD); Current - Temperature Rise: -; Type: -; Q @ Freq: -; Package / Case: 0.189" L x 0.189" W x 0.071" H (4.80mm x 4.80mm x 1.80mm); Packaging: Cut Tape (CT); Operating Temperature: -40°C ~ 125°C; Material - Core: -; Applications: General Purpose; ComponentLink1URL: http://katalog.we-online.de/kataloge/eisos/media/pdf/744042004.pdf; ComponentLink1Description: http://katalog.we-online.de/kataloge/eisos/media/pdf/744042004.pdf
R141 = R_0402_536k: RES SMD 536K OHM 1% 1/16W 0402; Manufacturer: Vishay Dale; Temperature Coefficient: ±100ppm/°C; Supplier 1: Digi-Key; Manufacturer Part Number: CRCW0402536KFKED; RoHS: RoHS Compliant; Category: Resistors; Stock 1: 43464; Pricing 1: 10=0.083, 50=0.0444, 200=0.0255, 1000=0.0174 (USD); Packaging: Cut Tape (CT); Resistance (Ohms): 536k; Composition: Thick Film; Features: Automotive AEC-Q200; Operating Temperature: -55°C ~ 155°C; Package / Case: 0402 (1005 Metric); Supplier Device Package: 0402 (1005 Metric); Size / Dimension: 0.039" L x 0.020" W (1.00mm x 0.50mm); Height: 0.016" (0.40mm); Number of Terminations: 2; ComponentLink1URL: http://www.vishay.com/docs/20035/dcrcwe3.pdf; ComponentLink1Description: http://www.vishay.com/docs/20035/dcrcwe3.pdf; Supplier Part Number 1: 541-536KLCT-ND
R142 = R_0402_178K: RES TF 178K OHM 1% 1/16W 0402; Manufacturer: Stackpole Electronics Inc; Manufacturer Part Number: RMCF0402FT178K; Temperature Coefficient: ±100ppm/°C; Supplier 1: Digi-Key; Supplier Part Number 1: RMCF0402FT178KCT-ND; RoHS: RoHS Compliant; Category: Resistors; Stock 1: 15389; Pricing: 1=0.04, 10=0.025, 50=0.0138, 100=0.0105, 250=0.0078, 500=0.00576, 1000=0.00384, 2500=0.00324, 5000=0.0027 (USD); Resistance (Ohms): 178k; Composition: Thick Film; Features: -; Package / Case: 0402 (1005 Metric); Size / Dimension: 0.039" L x 0.020" W (1.00mm x 0.50mm); Height: 0.016" (0.40mm); Number of Terminations: 2; Packaging: Cut Tape (CT); ComponentLink1URL: http://www.seielect.com/Catalog/SEI-RMCF_RMCP.pdf; ComponentLink1Description: http://www.seielect.com/Catalog/SEI-RMCF_RMCP.pdf; Resistance In Ohms: 178k
R143 = R_0402_12.4K: RES 12.4K OHM 1/10W 1% 0402 SMD; Manufacturer: Panasonic - ECG; Manufacturer Part Number: ERJ-2RKF1242X; Temperature Coefficient: ±100ppm/°C; Supplier 1: Digi-Key; Supplier Part Number 1: P12.4KLCT-ND; RoHS: RoHS Compliant; Category: Resistors; Stock 1: 212410; Pricing: 1=0.06, 50=0.0242, 100=0.0184, 250=0.01364, 500=0.01008, 1000=0.00672, 5000=0.00473 (USD); Composition: Thick Film; Features: -; Size / Dimension: 0.039" L x 0.020" W (1.00mm x 0.50mm); Height: 0.014" (0.35mm); Number of Terminations: 2; Packaging: Cut Tape (CT); ComponentLink1URL: http://industrial.panasonic.com/www-cgi/jvcr13pz.cgi?E+PZ+3+AOA0002+ERJ2RKF1242X+7+WW; ComponentLink1Description: http://industrial.panasonic.com/www-cgi/jvcr13pz.cgi?E+PZ+3+AOA0002+ERJ2RKF1242X+7+WW
R144 = R_0402_10.0K: as R79-R85 on sheet WIFI Bluetooth; Supplier 1: Digi-Key; Supplier Part Number 1: RMCF0402FT10K0CT-ND; RoHS: RoHS Compliant; Category: Resistors; Stock 1: 234525; Pricing: 1=0.04, 10=0.025, 50=0.0138, 100=0.0105, 250=0.0078, 500=0.00576, 1000=0.00384, 2500=0.00324, 5000=0.0027 (USD); Composition: Thick Film; Features: -; Package / Case: 0402 (1005 Metric); Size / Dimension: 0.039" L x 0.020" W (1.00mm x 0.50mm); Height: 0.016" (0.40mm); Number of Terminations: 2; Packaging: Cut Tape (CT); ComponentLink1URL: http://www.seielect.com/Catalog/SEI-RMCF_RMCP.pdf; ComponentLink1Description: http://www.seielect.com/Catalog/SEI-RMCF_RMCP.pdf; COST_1: *; COST_100: *; COST_1000: *; MANF1: *; MANF1_PN: *; MANF2: *; MANF2_PN: *; MANF3: *; MANF3_PN: *; VENDOR1: *; VENDOR1_PN: *
R145 = R_0402_7.87K: RES 7.87K OHM 1/16W 1% 0402 SMD; Manufacturer: Yageo; Manufacturer Part Number: RC0402FR-077K87L; Temperature Coefficient: ±100ppm/°C; Supplier 1: Digi-Key; Supplier Part Number 1: 311-7.87KLRCT-ND; RoHS: RoHS Compliant; Category: Resistors; Stock 1: 36940; Pricing: 10=0.014, 50=0.0104, 100=0.0079, 250=0.00584, 500=0.00432, 1000=0.00288 (USD); Resistance (Ohms): 7.87K; Composition: Thick Film; Features: -; Size / Dimension: 0.039" L x 0.020" W (1.00mm x 0.50mm); Height: 0.016" (0.40mm); Number of Terminations: 2; Packaging: Cut Tape (CT); Package / Case: 0402 (1005 Metric); ComponentLink1URL: http://www.yageo.com/documents/recent/PYu-RC0402_51_RoHS_L_6.pdf; ComponentLink1Description: http://www.yageo.com/documents/recent/PYu-RC0402_51_RoHS_L_6.pdf
R146 = R_0402_3.09K: RES 3.09K OHM 1/10W 1% 0402 SMD; Manufacturer: Panasonic - ECG; Manufacturer Part Number: ERJ-2RKF3091X; Temperature Coefficient: ±100ppm/°C; Supplier 1: Digi-Key; Supplier Part Number 1: P3.09KLCT-ND; RoHS: RoHS Compliant; Category: Resistors; Stock 1: 532395; Pricing: 1=0.06, 50=0.0242, 100=0.0184, 250=0.01364, 500=0.01008, 1000=0.00672, 5000=0.00473 (USD); Resistance (Ohms): 3.09K; Composition: Thick Film; Features: -; Size / Dimension: 0.039" L x 0.020" W (1.00mm x 0.50mm); Height: 0.016" (0.40mm); Number of Terminations: 2; Packaging: Cut Tape (CT); Package / Case: 0402 (1005 Metric); ComponentLink1URL: http://industrial.panasonic.com/www-cgi/jvcr13pz.cgi?E+PZ+3+AOA0002+ERJ2RKF3091X+7+WW; ComponentLink1Description: http://industrial.panasonic.com/www-cgi/jvcr13pz.cgi?E+PZ+3+AOA0002+ERJ2RKF3091X+7+WW
U12 = U_LD1117S18TR: IC REG LDO 1.8V 950MA SOT-223; Manufacturer: STMicroelectronics; Voltage - Input: Up to 15V; Number of Regulators: 1; Supplier 1: Digi-Key; Supplier Part Number 1: 497-7308-1-ND; Manufacturer Part Number: LD1117S18TR; RoHS: RoHS Compliant; Category: Integrated Circuits (ICs); Stock 1: 29995; Pricing: 1=0.54, 10=0.436, 100=0.3267, 250=0.28216, 500=0.24256, 1000=0.1881 (USD); Current - Output: 950mA; Current - Limit (Min): -; Operating Temperature: 0°C ~ 125°C; Mounting Type: Surface Mount; Package / Case: TO-261-4, TO-261AA; Packaging: Cut Tape (CT); ComponentLink1URL: http://www.st.com/internet/com/TECHNICAL_RESOURCES/TECHNICAL_LITERATURE/DATASHEET/CD00000544.pdf; ComponentLink1Description: http://www.st.com/internet/com/TECHNICAL_RESOURCES/TECHNICAL_LITERATURE/DATASHEET/CD00000544.pdf
U26 = U_TPS54320RHLT: IC REG BUCK ADJ 3A SYNC 14QFN; Function: Step-Down; Output Configuration: Positive; Output Type: Adjustable; Number of Outputs: 1; Frequency - Switching: 200kHz ~ 1.2MHz; Synchronous Rectifier: Yes; Supplier 1: Digi-Key; RoHS: RoHS Compliant; Category: Integrated Circuits (ICs); Stock 1: 3912; Pricing 1: 1=4.25, 10=3.815, 100=3.1296 (USD); Packaging: Cut Tape (CT); Topology: Buck; Current - Output: 3A; Operating Temperature: -40°C ~ 150°C (TJ); Mounting Type: Surface Mount; Package / Case: 14-VFQFN Exposed Pad; Supplier Device Package: 14-QFN (3.5x3.5); ComponentLink1URL: http://www.ti.com/lit/ds/symlink/tps54320.pdf; ComponentLink1Description: http://www.ti.com/lit/ds/symlink/tps54320.pdf; Supplier Part Number 1: 296-28064-1-ND

## Nets that join several sheets
GND: Battery Manager (11 pins), SOM Power (42 pins), SOM Analog USB (U2.N13), User Interface (46 pins), WIFI Bluetooth (84 pins), Cart (7 pins), Audio Codec (22 pins), 1.8V Regulator (C31.1 C57.1 U12.1)
V1P8: User Interface (C85.2 C87.2 J16.2 J17.2), WIFI Bluetooth (13 pins), Cart (6 pins), Audio Codec (C71.2 C72.2 U15.21), 1.8V Regulator (C57.2 U12.2)
V3P3: SOM Power (R49.1 R50.1), User Interface (10 pins), WIFI Bluetooth (5 pins), Cart (6 pins), Audio Codec (7 pins)
V5P0: SOM Power (T5.1 U2.P10 U2.R10 U2.T10), SOM Analog USB (U2.M15), Cart (J6.1), Audio Codec (C79.2 C80.2 U15.18), 1.8V Regulator (C31.2 U12.3)
ALERT: Battery Manager (U1.14), User Interface (U5.14)
HP_DETECT_N: User Interface (U5.8), Audio Codec (J19.4 R130.2)

## Assembly variants
Main Build: not fitted J1 J4 J6 J7 J9 J13 J18 J28 L2 L3 L5 L6 R52 R56 R57 R104 R105 R136 S2